# EAGLE schematic payload_board (EAGLE 9.6.2)
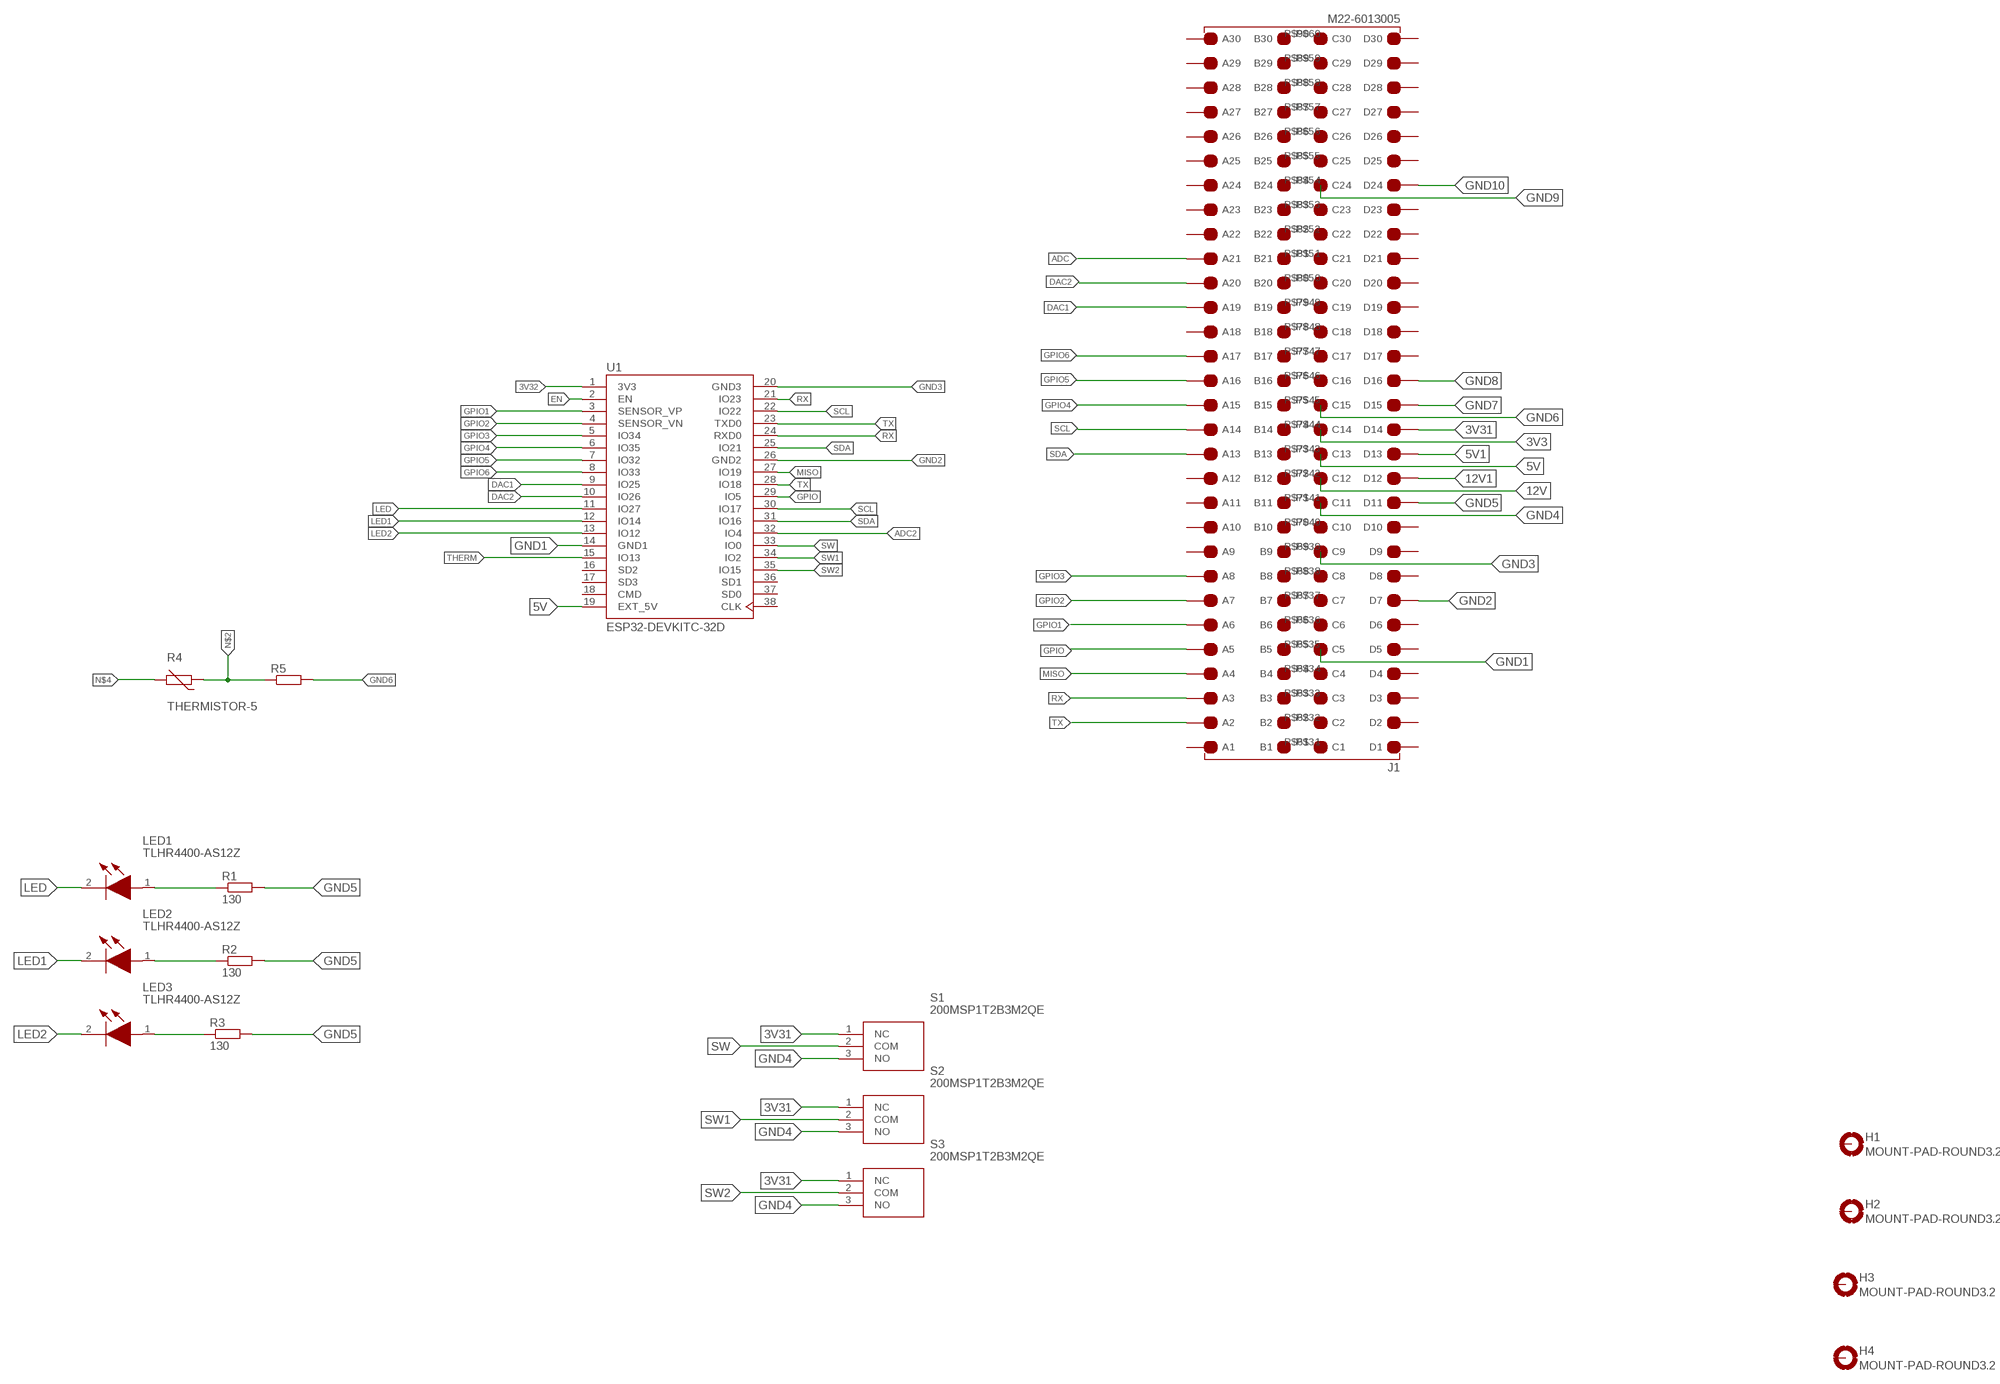
[diagram p0: schematic, sheet 1]

## Parts
H1  MOUNT-PAD-ROUND3.2  [3,2-PAD]
H2  MOUNT-PAD-ROUND3.2  [3,2-PAD]
H3  MOUNT-PAD-ROUND3.2  [3,2-PAD]
H4  MOUNT-PAD-ROUND3.2  [3,2-PAD]
J1  M22-6013005  [RHDR120W55P200_4X30_6020X820X9]
LED1  TLHR4400-AS12Z  [TLHR4400AS12Z]
LED2  TLHR4400-AS12Z  [TLHR4400AS12Z]
LED3  TLHR4400-AS12Z  [TLHR4400AS12Z]
R1  130  R-EU_0204/7  [0204/7]
R2  130  R-EU_0204/7  [0204/7]
R3  130  R-EU_0204/7  [0204/7]
R4  THERMISTOR-5  [R-5]
R5  130  R-EU_0204/7  [0204/7]
S1  200MSP1T2B3M2QE  [200MSP1T2B3M2QE]
S2  200MSP1T2B3M2QE  [200MSP1T2B3M2QE]
S3  200MSP1T2B3M2QE  [200MSP1T2B3M2QE]
U1  ESP32-DEVKITC-32D  [MODULE_ESP32-DEVKITC-32D]

## Nets
3V3: J1.P$44(C14)
3V31: J1.P$14(D14) S1.1(NC) S2.1(NC) S3.1(NC)
3V32: U1.1(3V3)
5V: J1.P$43(C13) U1.19(EXT_5V)
5V1: J1.P$13(D13)
12V: J1.P$42(C12)
12V1: J1.P$12(D12)
ADC: J1.P$111(A21)
ADC2: U1.32(IO4)
DAC1: J1.P$109(A19) U1.9(IO25)
DAC2: J1.P$110(A20) U1.10(IO26)
EN: U1.2(EN)
GND1: J1.P$35(C5) U1.14(GND1)
GND2: J1.P$7(D7) U1.26(GND2)
GND3: J1.P$39(C9) U1.20(GND3)
GND4: J1.P$41(C11) S1.3(NO) S2.3(NO) S3.3(NO)
GND5: J1.P$11(D11) R1.2 R2.2 R3.2
GND6: J1.P$45(C15) R5.2
GND7: J1.P$15(D15)
GND8: J1.P$16(D16)
GND9: J1.P$54(C24)
GND10: J1.P$24(D24)
GPIO: J1.P$95(A5) U1.29(IO5)
GPIO1: J1.P$96(A6) U1.3(SENSOR_VP)
GPIO2: J1.P$97(A7) U1.4(SENSOR_VN)
GPIO3: J1.P$98(A8) U1.5(IO34)
GPIO4: J1.P$105(A15) U1.6(IO35)
GPIO5: J1.P$106(A16) U1.7(IO32)
GPIO6: J1.P$107(A17) U1.8(IO33)
LED: LED1.2(K) U1.11(IO27)
LED1: LED2.2(K) U1.12(IO14)
LED2: LED3.2(K) U1.13(IO12)
MISO: J1.P$94(A4) U1.27(IO19)
N$1: LED1.1(A) R1.1
N$2: R4.1 R5.1
N$3: LED2.1(A) R2.1
N$4: R4.2
N$6: LED3.1(A) R3.1
RX: J1.P$93(A3) U1.21(IO23) U1.24(RXD0)
SCL: J1.P$104(A14) U1.22(IO22) U1.30(IO17)
SDA: J1.P$103(A13) U1.25(IO21) U1.31(IO16)
SW: S1.2(COM) U1.33(IO0)
SW1: S2.2(COM) U1.34(IO2)
SW2: S3.2(COM) U1.35(IO15)
THERM: U1.15(IO13)
TX: J1.P$92(A2) U1.23(TXD0) U1.28(IO18)
Unconnected: H1.B3,2(MOUNT) H2.B3,2(MOUNT) H3.B3,2(MOUNT) H4.B3,2(MOUNT) J1.P$1(D1) J1.P$2(D2) J1.P$3(D3) J1.P$4(D4) J1.P$5(D5) J1.P$6(D6) J1.P$8(D8) J1.P$9(D9) J1.P$10(D10) J1.P$17(D17) J1.P$18(D18) J1.P$19(D19) J1.P$20(D20) J1.P$21(D21) J1.P$22(D22) J1.P$23(D23) J1.P$25(D25) J1.P$26(D26) J1.P$27(D27) J1.P$28(D28) J1.P$29(D29) J1.P$30(D30) J1.P$31(C1) J1.P$32(C2) J1.P$33(C3) J1.P$34(C4) J1.P$36(C6) J1.P$37(C7) J1.P$38(C8) J1.P$40(C10) J1.P$46(C16) J1.P$47(C17) J1.P$48(C18) J1.P$49(C19) J1.P$50(C20) J1.P$51(C21) J1.P$52(C22) J1.P$53(C23) J1.P$55(C25) J1.P$56(C26) J1.P$57(C27) J1.P$58(C28) J1.P$59(C29) J1.P$60(C30) J1.P$61(B1) J1.P$62(B2) J1.P$63(B3) J1.P$64(B4) J1.P$65(B5) J1.P$66(B6) J1.P$67(B7) J1.P$68(B8) J1.P$69(B9) J1.P$70(B10) J1.P$71(B11) J1.P$72(B12) J1.P$73(B13) J1.P$74(B14) J1.P$75(B15) J1.P$76(B16) J1.P$77(B17) J1.P$78(B18) J1.P$79(B19) J1.P$80(B20) J1.P$81(B21) J1.P$82(B22) J1.P$83(B23) J1.P$84(B24) J1.P$85(B25) J1.P$86(B26) J1.P$87(B27) J1.P$88(B28) J1.P$89(B29) J1.P$90(B30) J1.P$91(A1) J1.P$99(A9) J1.P$100(A10) J1.P$101(A11) J1.P$102(A12) J1.P$108(A18) J1.P$112(A22) J1.P$113(A23) J1.P$114(A24) J1.P$115(A25) J1.P$116(A26) J1.P$117(A27) J1.P$118(A28) J1.P$119(A29) J1.P$120(A30) U1.16(SD2) U1.17(SD3) U1.18(CMD) U1.36(SD1) U1.37(SD0) U1.38(CLK)

## Library data of the parts
H1-H4 = holes:MOUNT-PAD-ROUND: MOUNTING PAD, round
J1 = M22-6013005:M22-6013005: HARWIN - M22-6013005 - PCB Receptacle, Board-to-Board, 2 mm, 4 Rows, 120 Contacts, Through Hole Mount, M22 Series Source: Datasheet <https://ms.componentsearchengine.com/Datasheets/2/M22-6013005.pdf>; DESCRIPTION: HARWIN - M22-6013005 - PCB Receptacle, Board-to-Board, 2 mm, 4 Rows, 120 Contacts, Through Hole Mount, M22 Series; HEIGHT: 9.65mm; MANUFACTURER_NAME: Harwin; MANUFACTURER_PART_NUMBER: M22-6013005
LED1-LED3 = TLHR4400-AS12Z:TLHR4400-AS12Z: Standard LEDs - Through Hole Red 13mcd; 3mm 612-625nm; 2V Typ Source: Datasheet <https://componentsearchengine.com/Datasheets/2/TLHR4400-AS12Z.pdf>; DESCRIPTION: Standard LEDs - Through Hole Red 13mcd; 3mm 612-625nm; 2V Typ; HEIGHT: 6.1mm; MANUFACTURER_NAME: Vishay; MANUFACTURER_PART_NUMBER: TLHR4400-AS12Z; MOUSER_PART_NUMBER: 78-TLHR4400-AS12Z; MOUSER_PRICE-STOCK: https://www.mouser.co.uk/ProductDetail/Vishay-Semiconductors/TLHR4400-AS12Z?qs=nQ9vpdMXC6AwxmxsGskxgg%3D%3D
R1-R3 R5 = rcl:R-EU_: RESISTOR, European symbol; SPICEPREFIX: R
R4 = varistor:THERMISTOR: THERMISTOR
S1-S3 = 200MSP1T2B3M2QE:200MSP1T2B3M2QE: Toggle Switches Sub-Mini Toggle, 100mA 2-4VDC, IP67 Source: Datasheet <https://4donline.ihs.com/images/VipMasterIC/IC/ESCH/ESCH-S-A0005347764/ESCH-S-A0005347781-1.pdf?hkey=EF798316E3902B6ED9A73243A3159BB0>; DESCRIPTION: Toggle Switches Sub-Mini Toggle, 100mA 2-4VDC, IP67; HEIGHT: 19.56mm; MANUFACTURER_NAME: E-Switch; MANUFACTURER_PART_NUMBER: 200MSP1T2B3M2QE; MOUSER_PART_NUMBER: 612-200MSP1T2B3M2QE; MOUSER_PRICE-STOCK: https://www.mouser.co.uk/ProductDetail/E-Switch/200MSP1T2B3M2QE?qs=xQzBpF%2FAFTpv05oBtdIhow%3D%3D
U1 = ESP32-DEVKITC-32D:ESP32-DEVKITC-32D: Eval Board For Esp-Wroom-32 Check prices <https://pricing.snapeda.com/parts/ESP32-DEVKITC-32D/Espressif%20Systems/view-part?ref=eda>; AVAILABILITY: Warning; DESCRIPTION: - Transceiver; 802.11 b/g/n (Wi-Fi, WiFi, WLAN), Bluetooth® Smart Ready 4.x Dual Mode For Use With ESP-WROOM-32; MF: Espressif Systems; MP: ESP32-DEVKITC-32D; PACKAGE: None; PRICE: None; PURCHASE-URL: https://pricing.snapeda.com/search/part/ESP32-DEVKITC-32D/?ref=eda